# EAGLE design dualHbridge-v4 (EAGLE 8.7.1)
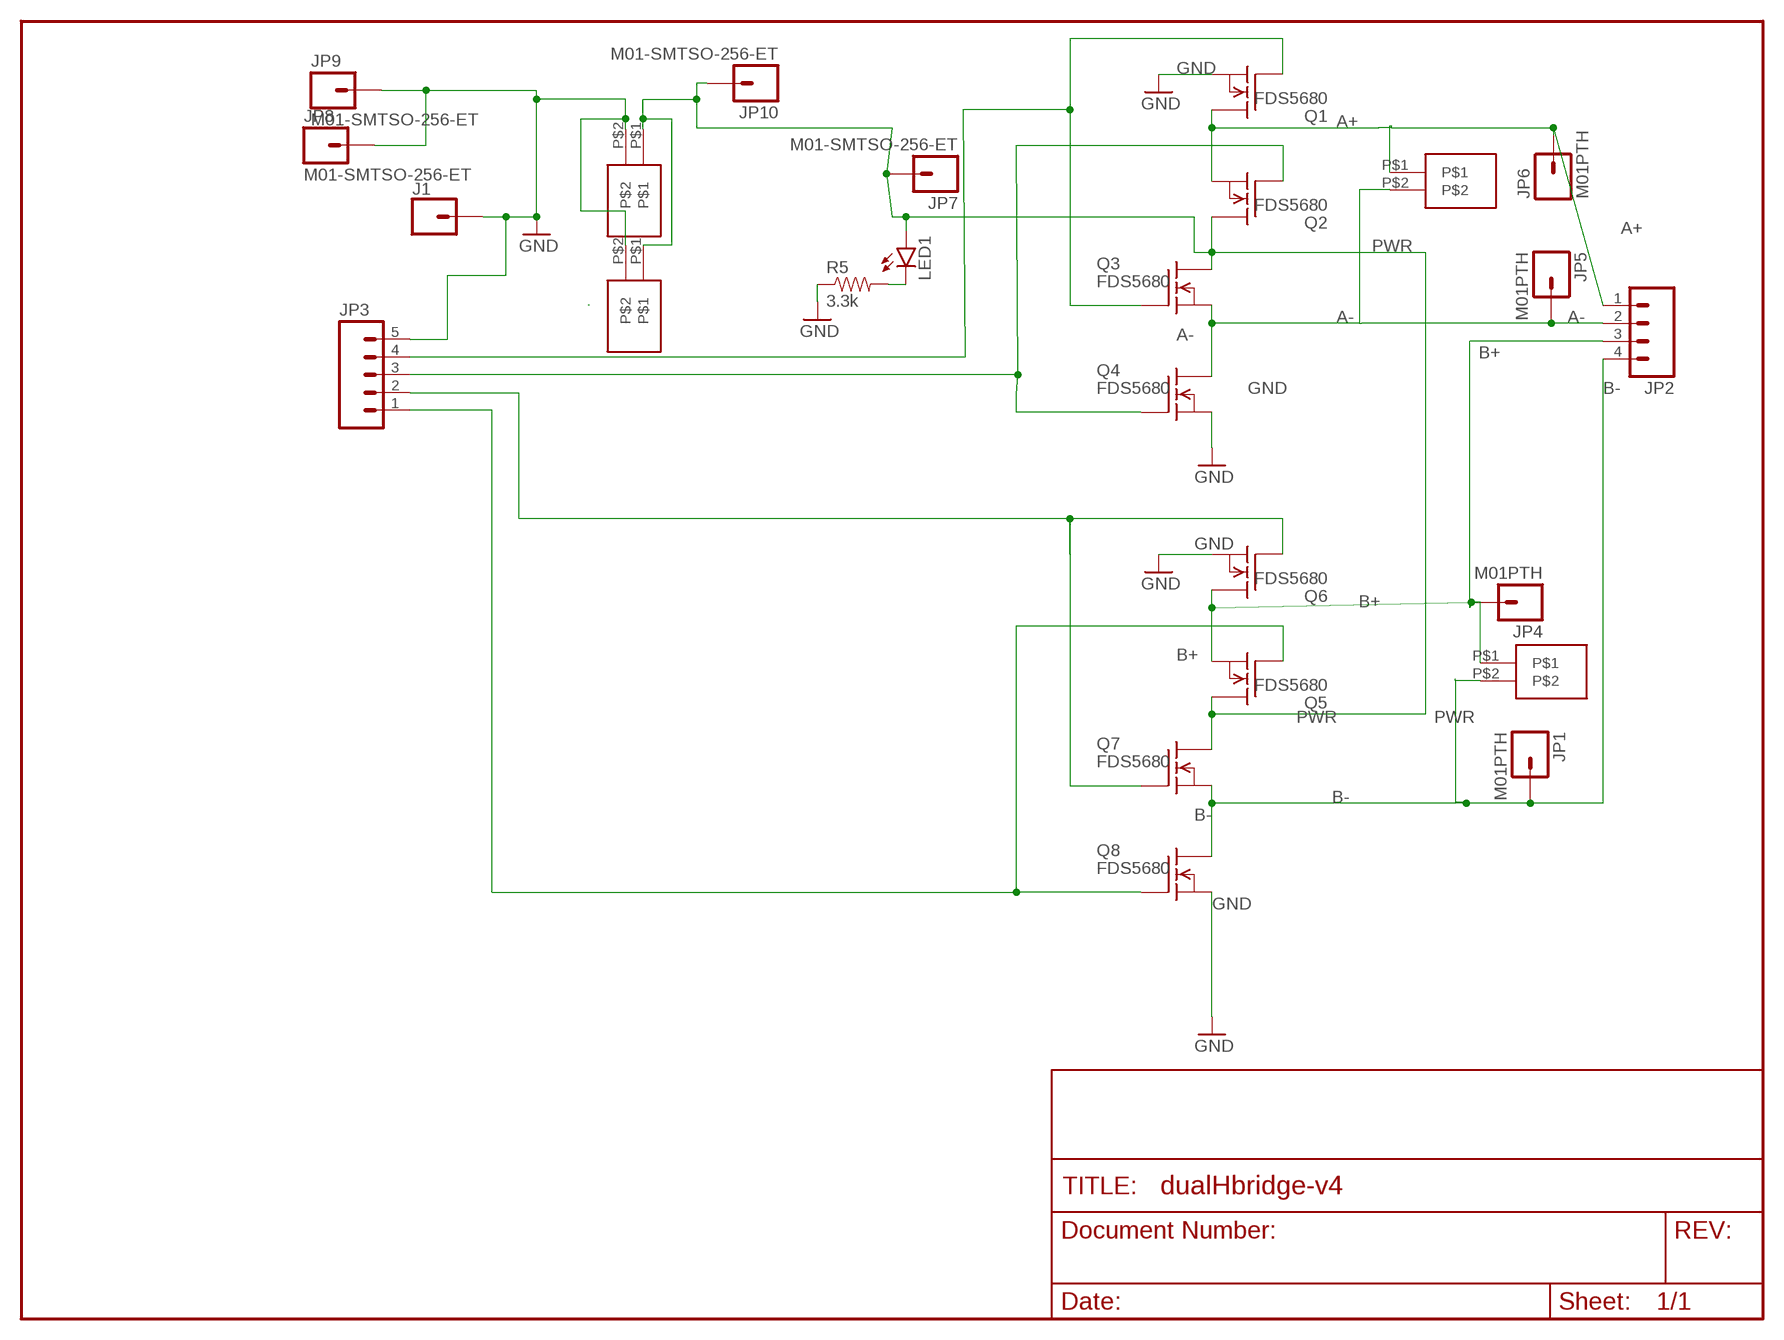
[diagram p0: schematic, sheet 1]

## Parts
J1  CONN_01  [1X01]
JP1  M01PTH  [1X01@1]
JP2  M04LONGPADS  [1X04_LONGPADS]
JP3  M05PTH  [1X05]
JP4  M01PTH  [1X01@1]
JP5  M01PTH  [1X01@1]
JP6  M01PTH  [1X01@1]
JP7  M01-SMTSO-256-ET  [SMTSO-256-ET]
JP8  M01-SMTSO-256-ET  [SMTSO-256-ET]
JP9  M01-SMTSO-256-ET  [SMTSO-256-ET]
JP10  M01-SMTSO-256-ET  [SMTSO-256-ET]
LED1  LED5MM  [LED5MM]
Q1  FDS5680  [SO-8]
Q2  FDS5680  [SO-8]
Q3  FDS5680  [SO-8]
Q4  FDS5680  [SO-8]
Q5  FDS5680  [SO-8]
Q6  FDS5680  [SO-8]
Q7  FDS5680  [SO-8]
Q8  FDS5680  [SO-8]
R5  3.3k  RESISTOR0603-RES  [0603-RES]
U$1  SPRING-TERMINAL  [SPRING-TERMINAL]
U$2  SPRING-TERMINAL  [SPRING-TERMINAL]
U$3  SPRING-TERMINAL  [SPRING-TERMINAL]
U$4  SPRING-TERMINAL  [SPRING-TERMINAL]

## Nets
A+: JP2.1 JP6.1 Q1.5(D) Q1.6(D) Q1.7(D) Q1.8(D) Q2.1(S) Q2.2(S) Q2.3(S) U$1.P$1
A-: JP2.2 JP5.1 Q3.1(S) Q3.2(S) Q3.3(S) Q4.5(D) Q4.6(D) Q4.7(D) Q4.8(D) U$1.P$2
B+: JP2.3 JP4.1 Q5.1(S) Q5.2(S) Q5.3(S) Q6.5(D) Q6.6(D) Q6.7(D) Q6.8(D) U$3.P$1
B-: JP1.1 JP2.4 Q7.1(S) Q7.2(S) Q7.3(S) Q8.5(D) Q8.6(D) Q8.7(D) Q8.8(D) U$3.P$2
GND: J1.1 JP3.5 JP8.P$1 JP9.P$1 Q1.1(S) Q1.2(S) Q1.3(S) Q4.1(S) Q4.2(S) Q4.3(S) Q6.1(S) Q6.2(S) Q6.3(S) Q8.1(S) Q8.2(S) Q8.3(S) R5.1 U$2.P$2 U$4.P$2
N$5: JP3.3 Q2.4(G) Q4.4(G)
N$6: JP3.4 Q1.4(G) Q3.4(G)
N$7: LED1.K(C) R5.2
N$13: JP3.2 Q6.4(G) Q7.4(G)
N$14: JP3.1 Q5.4(G) Q8.4(G)
PWR: JP7.P$1 JP10.P$1 LED1.A Q2.5(D) Q2.6(D) Q2.7(D) Q2.8(D) Q3.5(D) Q3.6(D) Q3.7(D) Q3.8(D) Q5.5(D) Q5.6(D) Q5.7(D) Q5.8(D) Q7.5(D) Q7.6(D) Q7.7(D) Q7.8(D) U$2.P$1 U$4.P$1

## Library data of the parts
J1 = SparkFun-Connectors:CONN_01: Single connection point. Often used as Generic Header-pin footprint for 0.1 inch spaced/style header connections On any of the 0.1 inch spaced packages, you can populate with these: Break Away Headers - Straight <https://www.sparkfun.com/products/116> (PRT-00116) Break Away Male Headers - Right Angle <https://www.sparkfun.com/products/553> (PRT-00553) Female Headers <https://www.sparkfun.com/products/115> (PRT-00115) Break Away Headers - Machine Pin <https://www.sparkfun.com/products/117> (PRT-00117) Break Away Female Headers - Swiss Machine Pin <https://www.sparkfun.com/products/743> (PRT-00743) This device is also useful as a general connection point to wire up your design to another part of your project. Our various solder wires solder well into these plated through hole pads. Hook-Up Wire - Assortment (Stranded, 22 AWG) <https://www.sparkfun.com/products/11375> (PRT-11375) Hook-Up Wire - Assortment (Solid Core, 22 AWG) <https://www.sparkfun.com/products/11367> (PRT-11367) View the entire wire category on our website here <https://www.sparkfun.com/categories/141> Special notes: SMTSO-256-ET is a "flush mount" nut for a 4-40 screw. We mostly use this on specialty testbeds; it is a nice way to connect hardware to your PCB at an adjustable hieght. Also note, the SNAP packages are for using a snappable style connector. We sell a baggie of snaps and they are also used on two LilyPad designs: Snap Assortment - 30 pack (male and female) <https://www.sparkfun.com/products/11347> (DEV-11347) LilyPad Arduino SimpleSnap <https://www.sparkfun.com/products/10941> (DEV-10941) LilyPad SimpleSnap Protoboard <https://www.sparkfun.com/products/10940> (DEV-10940)
JP1 JP4-JP10 = SparkFun-Connectors:M01: Header 1 Standard 1-pin 0.1" header. Use with straight break away headers (SKU : PRT-00116), right angle break away headers (PRT-00553), swiss pins (PRT-00743), machine pins (PRT-00117), and female headers (PRT-00115).
JP2 = SparkFun-Connectors:M04: Header 4 Standard 4-pin 0.1" header. Use with straight break away headers (SKU : PRT-00116), right angle break away headers (PRT-00553), swiss pins (PRT-00743), machine pins (PRT-00117), and female headers (PRT-00115). Molex polarized connector foot print use with SKU : PRT-08231 with associated crimp pins and housings. 1MM SMD Version SKU: PRT-10208
JP3 = SparkFun-Connectors:M05: Header 5 Standard 5-pin 0.1" header. Use with straight break away headers (SKU : PRT-00116), right angle break away headers (PRT-00553), swiss pins (PRT-00743), machine pins (PRT-00117), and female headers (PRT-00115). Molex polarized connector foot print use with SKU : PRT-08230 with associated crimp pins and housings.
LED1 = SparkFun-LED:LED: LEDs Standard schematic elements and footprints for 5mm, 3mm, 1206, and 0603 sized LEDs. 5mm - Spark Fun Electronics SKU : COM-00529 (and others)
Q1-Q8 = transistor-fet:FDS5680: 60V N-Channel PowerTrench TM MOSFET FAIRCHILD FDS5680.pdf
R5 = SparkFun-Passives:RESISTOR: Resistor Basic schematic elements and footprints for 0603, 1206, and PTH resistors.
U$1-U$4 = spietz-library:SPRING-TERMINAL

## Net classes
0 default: width 0.203 mm
1 vcc: width 0.254 mm

## Board
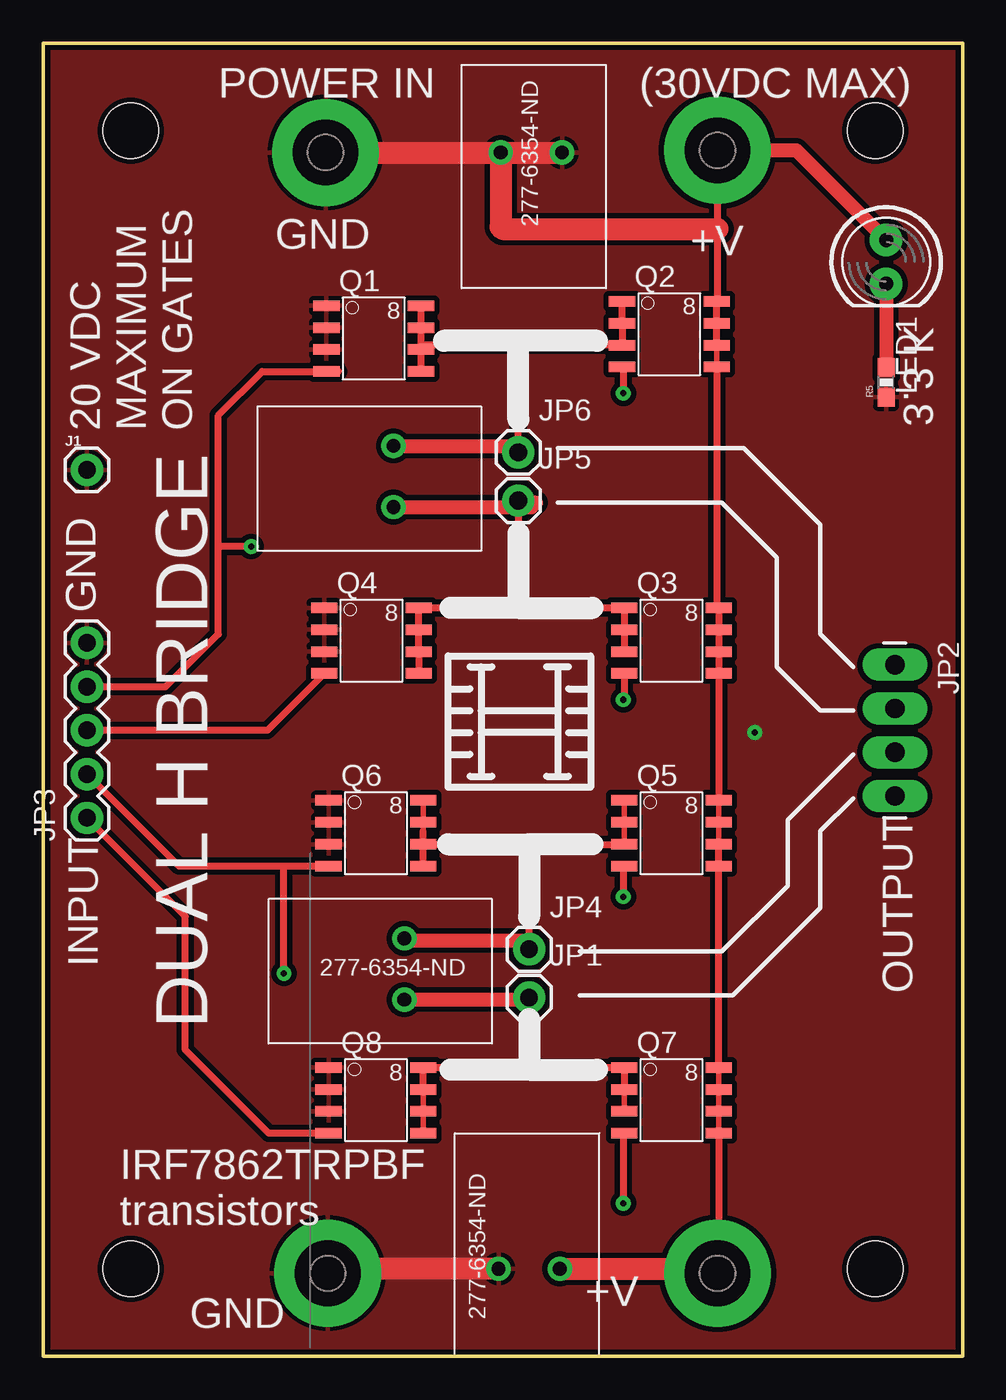
[diagram p1: board, top side]
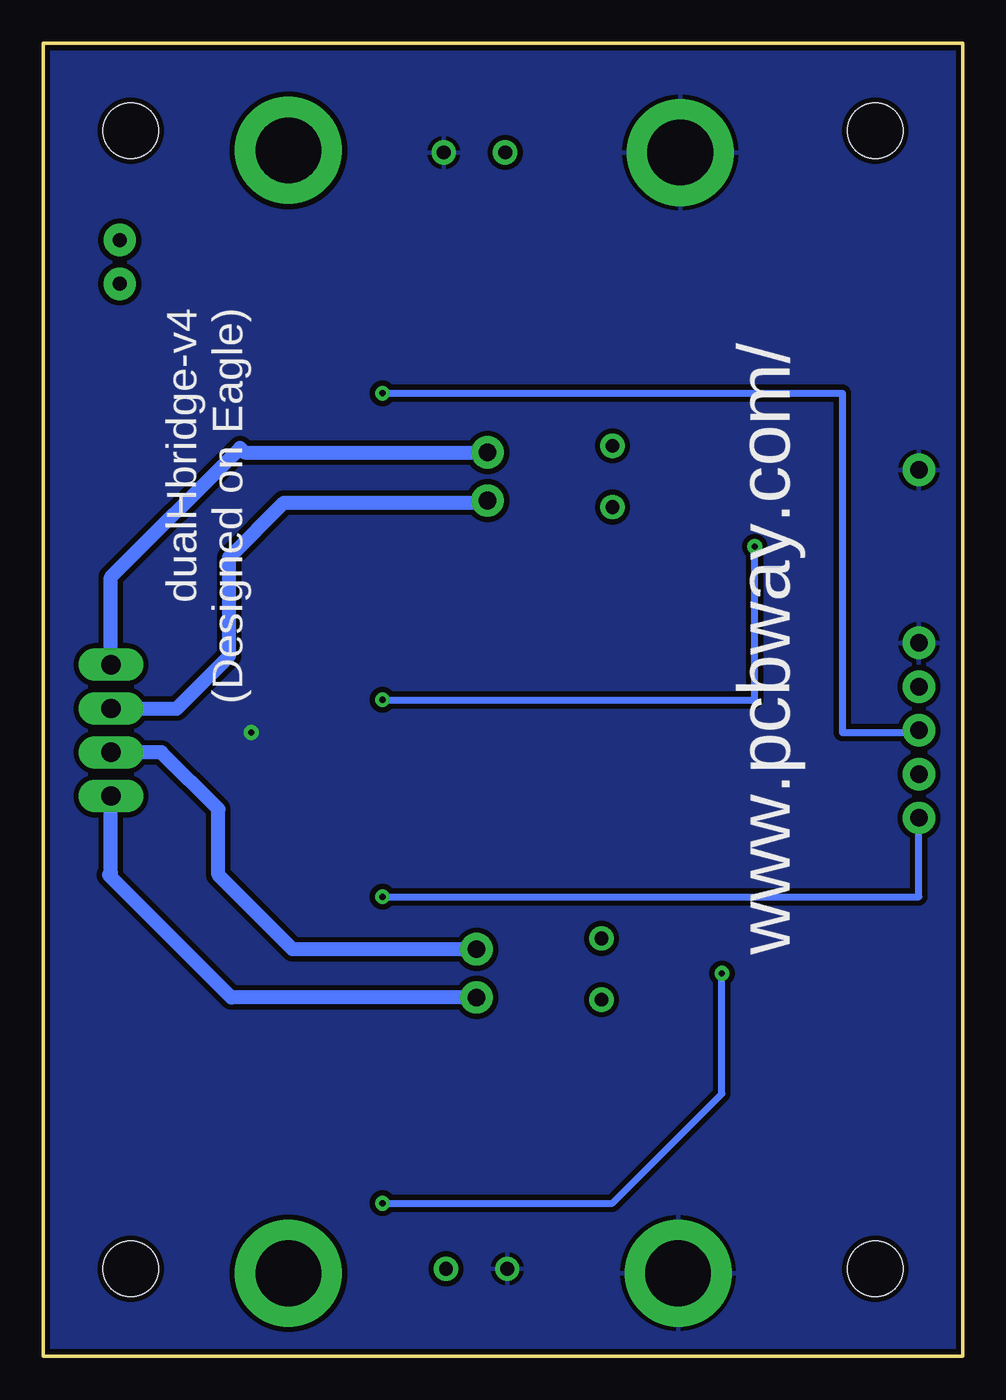
[diagram p2: board, bottom side, seen from below]

Size 53.34 x 76.2 mm. Coordinates in mm from the lower left corner, seen from the top.
Outline: 0,76.2 0,0 53.34,0 53.34,76.2 0,76.2
Copper layers (1*16): Top 0.035mm / dielectric 1.5mm / Bottom 0.035mm
Design rules "SparkFun": minimum track width 8mil, minimum drill 20mil, track to track 8mil, track to pad 8mil, pad to pad 8mil, via to via 8mil, smd to smd 8mil, copper to edge 10mil, drill to drill 8mil, minimum pad ring 12mil, minimum via ring 10mil, stop-mask expansion 4mil, vias tented up to drill 25mil, thermal gap 10mil
Holes 3.2 mm at 5.08,71.12 48.26,71.12 5.08,5.08 48.26,5.08

### Footprints (pad centres in the part's own frame; a part is rotated, then mirrored left to right if it is on the bottom)
1X01 = drill 1.016 pad 1.88: 1 0,0
1X01@1 = drill 1.016 pad 1.88: 1 0,0
1X04_LONGPADS = drill 1.118 pad 1.88 long: 1 0,0; 2 2.54,0; 3 5.08,0; 4 7.62,0
1X05 = drill 1.016 pad 1.88: 1 0,0; 2 2.54,0; 3 5.08,0; 4 7.62,0; 5 10.16,0
SMTSO-256-ET = drill 3.81 pad 6.198: P$1 0,0
LED5MM = drill 0.813 pad 1.88: A -1.27,0; K 1.27,0
SO-8 = smd 1.524 x 0.61: 1 -2.743,1.905; 2 -2.743,0.635; 3 -2.743,-0.635; 4 -2.743,-1.905; 5 2.743,-1.905; 6 2.743,-0.635; 7 2.743,0.635; 8 2.743,1.905
0603-RES = smd 1.1 x 1: 1 -0.85,0; 2 0.85,0
SPRING-TERMINAL = drill 0.8: P$1 5.08,1.778; P$2 5.08,5.334

### Placement (x,y rotation side)
J1  2.54,51.44 0 top
JP1  28.19,20.83 0 top
JP2  49.4,40.13 270 top
JP3  2.54,31.24 90 top
JP4  28.19,23.62 0 top
JP5  27.56,49.66 0 top
JP6  27.56,52.45 0 top
JP7  39.12,4.83 0 top
JP8  16.51,4.83 0 top
JP9  16.38,69.85 0 top
JP10  39.12,69.98 0 top
LED1  48.9,63.5 270 top
Q1  19.18,59.05 0 top
Q2  36.32,59.31 0 top
Q3  36.45,41.53 0 top
Q4  19.05,41.53 0 top
Q5  36.45,30.35 0 top
Q6  19.3,30.35 0 top
Q7  36.45,14.86 0 top
Q8  19.3,14.86 0 top
R5  48.9,56.52 90 top
U$1  25.4,54.61 180 top
U$2  31.75,0 90 top
U$3  26.04,26.04 180 top
U$4  24.77,74.93 270 top

### Tracks (layer width: path | path; a pad name or v marks a point on that pad's centre or on a via)
A+
  Top 0.406: Q1.5 Q1.6 21.92,58.67 | Q1.8 Q1.7 21.92,58.67 | Q2.1 Q2.2 Q2.3 27.56,58.67 | 27.56,58.67 21.92,58.67 | JP6.1 27.56,52.7 27.56,58.67
  Top 0.813: U$1.P$1 27.81,52.83 27.94,52.7 27.56,52.7
  Bottom 0.813: JP2.1 49.4,45.21 41.91,52.7 41.66,52.45 JP6.1
A-
  Top 0.406: Q4.5 Q4.6 Q4.7 Q4.8 27.56,43.43 | Q3.3 Q3.2 Q3.1 27.56,43.43 | JP5.1 27.56,49.53 27.56,43.43
  Top 0.813: U$1.P$2 28.32,49.28 28.57,49.53 27.56,49.53
  Bottom 0.813: JP2.2 45.59,37.59 42.55,40.64 42.55,46.35 39.37,49.53 27.69,49.53 JP5.1
B+
  Top 0.305: Q5.3 Q5.2 Q5.1 | Q6.5 Q6.6 | 22.05,30.48 Q6.7 Q6.8
  Top 0.406: 22.23,29.72 Q6.6 22.05,30.48 | 22.23,29.72 28.57,29.72 | 28.57,29.72 Q5.3 | JP4.1 28.19,24.13 28.19,29.46 28.57,29.72 | Q6.5 22.05,29.54 22.23,29.72
  Top 0.813: U$3.P$1 21.08,24.13 28.19,24.13
  Bottom 0.813: JP4.1 38.86,23.62 43.18,27.94 43.18,31.75 46.48,35.05 JP2.3
B-
  Top 0.305: Q7.3 Q7.2 | Q8.7 Q8.6 Q8.5
  Top 0.406: Q8.7 Q8.8 27.94,16.76 | 27.94,16.76 Q7.1 Q7.2 | JP1.1 28.19,17.02 27.94,16.76
  Top 0.813: U$3.P$2 28.07,20.7 JP1.1
  Bottom 0.813: JP1.1 42.42,20.83 49.53,27.94 49.4,28.07 JP2.4
GND  (via drill 0.35)
  Top 0.305: 16.51,5.08 16.26,4.83 | 15.88,4.45 16.26,4.83 | 16.26,4.83 JP8.P$1
  Top 1.27: U$2.P$2 16.51,5.08 | JP9.P$1 U$4.P$2
  other vias: 41.27,36.2
  pour Top (isolate 0.305): 0,76.2 53.34,76.2 53.34,0 0,0
  pour Bottom (isolate 0.305): 0,76.2 53.34,76.2 53.34,0 0,0
N$5  (via drill 0.35)
  Top 0.406: Q4.4 13.01,36.32 JP3.3 | Q2.4 33.66,57.4 v33.66,55.88
  Bottom 0.406: v33.66,55.88 6.99,55.88 6.99,36.2 2.54,36.2 JP3.3
N$6  (via drill 0.35)
  Top 0.406: JP3.4 7.11,38.86 10.16,41.91 10.16,46.99 | 10.16,46.99 10.16,54.61 12.7,57.15 Q1.4 16.51,57.15 17.14,57.15 | Q3.4 33.71,38.1 v33.66,38.1 | v12.06,46.99 10.16,46.99
  Bottom 0.406: v33.66,38.1 12.06,38.1 v12.06,46.99
N$7
  Top 0.813: LED1.K R5.2
N$13  (via drill 0.35)
  Top 0.406: JP3.2 7.87,28.45 13.97,28.45 | 13.97,28.45 Q6.4 | Q7.4 33.66,12.95 v33.66,8.89 | v13.97,22.23 13.97,28.45
  Bottom 0.406: v33.66,8.89 20.32,8.89 13.97,15.24 v13.97,22.23
N$14  (via drill 0.35)
  Top 0.406: Q8.4 13.08,12.95 8.26,17.78 8.26,25.53 JP3.1 | Q5.4 33.66,28.45 v33.66,26.67
  Bottom 0.406: v33.66,26.67 2.54,26.67 JP3.1
PWR
  Top 0.305: Q7.5 Q7.6 Q7.7 Q7.8 | Q5.6 Q5.7 Q5.8 | Q2.5 Q2.6
  Top 0.406: Q2.6 Q2.7 Q2.8 39.12,61.21 39.12,65.41 JP10.P$1 | Q7.5 39.19,5.08 39.19,4.83 JP7.P$1 | Q7.8 Q5.5 Q5.6 | Q5.8 Q3.5 Q3.6 Q3.7 Q3.8 39.06,43.43 Q2.5
  Top 0.813: JP10.P$1 43.69,69.98 LED1.A
  Top 1.27: U$2.P$1 39.19,5.08 | U$4.P$1 26.54,65.53 26.67,65.41 39.12,65.41

### Text on the board
tPlace: 277-6354-ND | POWER IN (30VDC MAX) | GND | V+ | 20 VDC / MAXIMUM / ON GATES | 3.3 K | GND | INPUT | 277-6354-ND | OUTPUT | DUAL H BRIDGE | IRF7862TRPBF / transistors | V+ | GND | 277-6354-ND
bPlace: dualHbridge-v4 / (Designed on Eagle) | www.pcbway.com/
tValues: Tent Vias! | Arduino Wee v1.3